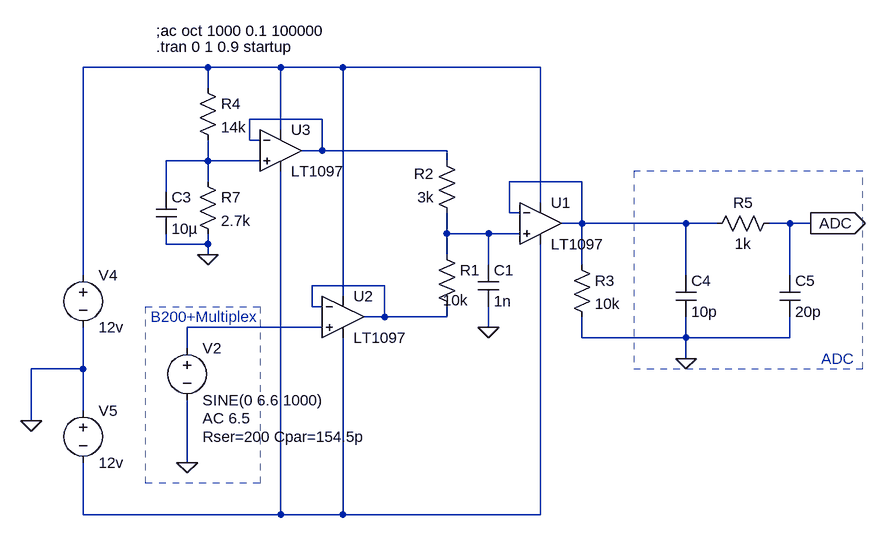
[diagram p0: schematic conditioning_simulation.asc]
conditioning_simulation.asc, the LTspice schematic file:
Version 4
SHEET 1 1028 680
WIRE -32 -112 -224 -112
WIRE 80 -112 -32 -112
WIRE 176 -112 80 -112
WIRE 480 -112 176 -112
WIRE -32 -80 -32 -112
WIRE 144 -32 32 -32
WIRE 80 -16 80 -112
WIRE 32 0 32 -32
WIRE 48 0 32 0
WIRE 144 16 144 -32
WIRE 144 16 112 16
WIRE 336 16 144 16
WIRE -32 32 -32 0
WIRE -32 32 -96 32
WIRE 48 32 -32 32
WIRE 336 32 336 16
WIRE -32 64 -32 32
WIRE 544 64 432 64
WIRE -96 80 -96 32
WIRE 480 96 480 -112
WIRE 432 112 432 64
WIRE 448 112 432 112
WIRE 544 128 544 64
WIRE 544 128 512 128
WIRE 704 128 544 128
WIRE 752 128 704 128
WIRE 864 128 832 128
WIRE 896 128 864 128
WIRE 336 144 336 112
WIRE 400 144 336 144
WIRE 448 144 400 144
WIRE -96 160 -96 144
WIRE -32 160 -32 144
WIRE -32 160 -96 160
WIRE -32 176 -32 160
WIRE 336 176 336 144
WIRE 400 192 400 144
WIRE 544 192 544 128
WIRE -224 208 -224 -112
WIRE 704 208 704 128
WIRE 864 208 864 128
WIRE 240 224 128 224
WIRE 176 240 176 -112
WIRE 128 256 128 224
WIRE 144 256 128 256
WIRE 240 272 240 224
WIRE 240 272 208 272
WIRE 336 272 336 256
WIRE 336 272 240 272
WIRE 144 288 -64 288
WIRE 400 288 400 256
WIRE 544 304 544 272
WIRE 704 304 704 272
WIRE 704 304 544 304
WIRE 864 304 864 272
WIRE 864 304 704 304
WIRE -64 320 -64 288
WIRE 704 336 704 304
WIRE -224 352 -224 288
WIRE -224 352 -304 352
WIRE -224 416 -224 352
WIRE -304 432 -304 352
WIRE -64 496 -64 400
WIRE -224 576 -224 496
WIRE 80 576 80 48
WIRE 80 576 -224 576
WIRE 176 576 176 304
WIRE 176 576 80 576
WIRE 480 576 480 160
WIRE 480 576 176 576
FLAG 896 128 ADC
IOPIN 896 128 Out
FLAG 704 336 0
FLAG 400 288 0
FLAG -32 176 0
FLAG -64 496 0
FLAG -304 432 0
SYMBOL voltage -64 304 R0
WINDOW 123 24 124 Left 2
WINDOW 39 24 152 Left 2
SYMATTR Value2 AC 6.5
SYMATTR SpiceLine Rser=200 Cpar=154.5p
SYMATTR InstName V2
SYMATTR Value SINE(0 6.6 1000)
SYMBOL res 320 160 R0
WINDOW 3 10 86 Left 2
SYMATTR Value 10k
SYMATTR InstName R1
SYMBOL res 352 128 R180
WINDOW 0 36 76 Left 2
WINDOW 3 36 40 Left 2
SYMATTR InstName R2
SYMATTR Value 3k
SYMBOL res 528 176 R0
SYMATTR InstName R3
SYMATTR Value 10k
SYMBOL voltage -224 192 R0
WINDOW 123 0 0 Left 2
WINDOW 39 0 0 Left 2
SYMATTR InstName V4
SYMATTR Value 12v
SYMBOL voltage -224 400 R0
WINDOW 123 0 0 Left 2
WINDOW 39 0 0 Left 2
SYMATTR InstName V5
SYMATTR Value 12v
SYMBOL cap 384 192 R0
SYMATTR InstName C1
SYMATTR Value 1n
SYMBOL res -48 -96 R0
SYMATTR InstName R4
SYMATTR Value 14k
SYMBOL res -48 48 R0
SYMATTR InstName R7
SYMATTR Value 2.7k
SYMBOL cap -112 80 R0
SYMATTR InstName C3
SYMATTR Value 10µ
SYMATTR SpiceLine Rser=10
SYMBOL cap 688 208 R0
SYMATTR InstName C4
SYMATTR Value 10p
SYMBOL cap 848 208 R0
SYMATTR InstName C5
SYMATTR Value 20p
SYMBOL res 848 112 R90
WINDOW 0 0 56 VBottom 2
WINDOW 3 32 56 VTop 2
SYMATTR InstName R5
SYMATTR Value 1k
SYMBOL Opamps\\LT1097 480 64 R0
SYMATTR InstName U1
SYMBOL Opamps\\LT1097 176 208 R0
SYMATTR InstName U2
SYMBOL Opamps\\LT1097 80 -48 R0
SYMATTR InstName U3
TEXT -112 -144 Left 2 !.tran 0 1 0.9 startup
TEXT -112 -168 Left 2 !;ac oct 1000 0.1 100000
TEXT 912 336 Left 2 ;ADC
TEXT -120 272 Left 2 ;B200+Multiplex
RECTANGLE Normal 976 48 624 352 2
RECTANGLE Normal 48 528 -128 256 2

The netlist it stands for:
* conditioning_simulation.asc
V2 N007 0 SINE(0 6.6 1000) AC 6.5 Rser=200 Cpar=154.5p
R1 N005 N006 10k
R2 N005 N002 3k
R3 N004 0 10k
V4 N001 0 12v
V5 0 N008 12v
C1 N005 0 1n
R4 N001 N003 14k
R7 N003 0 2.7k
C3 N003 0 10µ Rser=10
C4 N004 0 10p
C5 ADC 0 20p
R5 ADC N004 1k
XU1 N005 N004 N001 N008 N004 LT1097  ; pins In+ In- V+ V- OUT
XU2 N007 N006 N001 N008 N006 LT1097  ; pins In+ In- V+ V- OUT
XU3 N003 N002 N001 N008 N002 LT1097  ; pins In+ In- V+ V- OUT
.tran 0 1 0.9 startup
;ac oct 1000 0.1 100000
* ADC
* B200+Multiplex
.backanno
.end